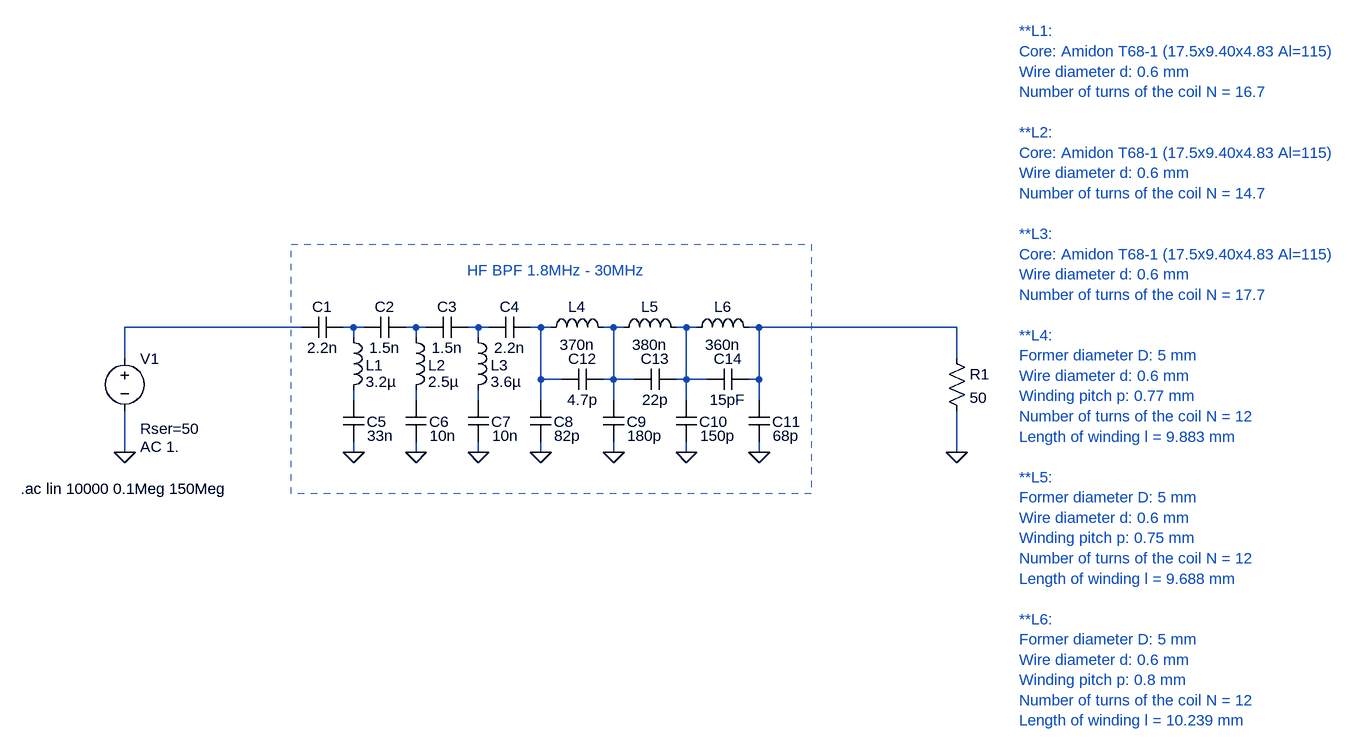
[diagram p0: schematic HF-BPF.asc]
HF-BPF.asc, the LTspice schematic file:
Version 4
SHEET 1 1608 680
WIRE -32 160 -304 160
WIRE 48 160 32 160
WIRE 64 160 48 160
WIRE 144 160 128 160
WIRE 160 160 144 160
WIRE 240 160 224 160
WIRE 256 160 240 160
WIRE 336 160 320 160
WIRE 352 160 336 160
WIRE 448 160 432 160
WIRE 464 160 448 160
WIRE 560 160 544 160
WIRE 576 160 560 160
WIRE 672 160 656 160
WIRE 976 160 672 160
WIRE 48 176 48 160
WIRE 144 176 144 160
WIRE 240 176 240 160
WIRE -304 208 -304 160
WIRE 976 208 976 160
WIRE 336 240 336 160
WIRE 368 240 336 240
WIRE 448 240 448 160
WIRE 448 240 432 240
WIRE 480 240 448 240
WIRE 560 240 560 160
WIRE 560 240 544 240
WIRE 592 240 560 240
WIRE 672 240 672 160
WIRE 672 240 656 240
WIRE 48 272 48 256
WIRE 144 272 144 256
WIRE 240 272 240 256
WIRE 336 272 336 240
WIRE 448 272 448 240
WIRE 560 272 560 240
WIRE 672 272 672 240
WIRE -304 352 -304 288
WIRE 48 352 48 336
WIRE 144 352 144 336
WIRE 240 352 240 336
WIRE 336 352 336 336
WIRE 448 352 448 336
WIRE 560 352 560 336
WIRE 672 352 672 336
WIRE 976 352 976 288
FLAG 48 352 0
FLAG 144 352 0
FLAG 240 352 0
FLAG 976 352 0
FLAG -304 352 0
FLAG 336 352 0
FLAG 448 352 0
FLAG 560 352 0
FLAG 672 352 0
SYMBOL cap 32 144 R90
WINDOW 0 0 32 VBottom 2
WINDOW 3 32 32 VTop 2
SYMATTR InstName C1
SYMATTR Value 2.2n
SYMBOL cap 128 144 R90
WINDOW 0 0 32 VBottom 2
WINDOW 3 32 32 VTop 2
SYMATTR InstName C2
SYMATTR Value 1.5n
SYMBOL cap 224 144 R90
WINDOW 0 0 32 VBottom 2
WINDOW 3 32 32 VTop 2
SYMATTR InstName C3
SYMATTR Value 1.5n
SYMBOL cap 320 144 R90
WINDOW 0 0 32 VBottom 2
WINDOW 3 32 32 VTop 2
SYMATTR InstName C4
SYMATTR Value 2.2n
SYMBOL ind 32 160 R0
WINDOW 0 35 58 Left 2
WINDOW 3 35 84 Left 2
SYMATTR InstName L1
SYMATTR Value 3.2µ
SYMBOL ind 128 160 R0
WINDOW 0 35 58 Left 2
WINDOW 3 35 84 Left 2
SYMATTR InstName L2
SYMATTR Value 2.5µ
SYMBOL ind 224 160 R0
WINDOW 0 35 58 Left 2
WINDOW 3 35 84 Left 2
SYMATTR InstName L3
SYMATTR Value 3.6µ
SYMBOL cap 32 272 R0
WINDOW 0 36 33 Left 2
WINDOW 3 37 55 Left 2
SYMATTR InstName C5
SYMATTR Value 33n
SYMBOL cap 128 272 R0
WINDOW 0 36 33 Left 2
WINDOW 3 37 55 Left 2
SYMATTR InstName C6
SYMATTR Value 10n
SYMBOL cap 224 272 R0
WINDOW 0 36 33 Left 2
WINDOW 3 37 55 Left 2
SYMATTR InstName C7
SYMATTR Value 10n
SYMBOL res 960 192 R0
SYMATTR InstName R1
SYMATTR Value 50
SYMBOL voltage -304 192 R0
WINDOW 3 24 152 Left 2
WINDOW 123 0 0 Left 0
WINDOW 39 24 124 Left 2
SYMATTR Value AC 1.
SYMATTR SpiceLine Rser=50
SYMATTR InstName V1
SYMBOL ind 336 176 R270
WINDOW 0 32 56 VTop 2
WINDOW 3 5 56 VBottom 2
SYMATTR InstName L4
SYMATTR Value 370n
SYMBOL ind 448 176 R270
WINDOW 0 32 56 VTop 2
WINDOW 3 5 56 VBottom 2
SYMATTR InstName L5
SYMATTR Value 380n
SYMBOL ind 560 176 R270
WINDOW 0 32 56 VTop 2
WINDOW 3 5 56 VBottom 2
SYMATTR InstName L6
SYMATTR Value 360n
SYMBOL cap 320 272 R0
WINDOW 0 36 33 Left 2
WINDOW 3 37 55 Left 2
SYMATTR InstName C8
SYMATTR Value 82p
SYMBOL cap 432 272 R0
WINDOW 0 36 33 Left 2
WINDOW 3 37 55 Left 2
SYMATTR InstName C9
SYMATTR Value 180p
SYMBOL cap 544 272 R0
WINDOW 0 36 33 Left 2
WINDOW 3 37 55 Left 2
SYMATTR InstName C10
SYMATTR Value 150p
SYMBOL cap 656 272 R0
WINDOW 0 36 33 Left 2
WINDOW 3 37 55 Left 2
SYMATTR InstName C11
SYMATTR Value 68p
SYMBOL cap 432 224 R90
WINDOW 0 0 32 VBottom 2
WINDOW 3 32 32 VTop 2
SYMATTR InstName C12
SYMATTR Value 4.7p
SYMBOL cap 544 224 R90
WINDOW 0 0 32 VBottom 2
WINDOW 3 32 32 VTop 2
SYMATTR InstName C13
SYMATTR Value 22p
SYMBOL cap 656 224 R90
WINDOW 0 0 32 VBottom 2
WINDOW 3 32 32 VTop 2
SYMATTR InstName C14
SYMATTR Value 15pF
TEXT -464 408 Left 2 !.ac lin 10000 0.1Meg 150Meg
TEXT 360 72 Center 2 ;HF BPF 1.8MHz - 30MHz
TEXT 1072 -296 Left 2 ;**L1:\nCore: Amidon T68-1 (17.5x9.40x4.83 Al=115)\nWire diameter d: 0.6 mm\nNumber of turns of the coil N = 16.7\n \n**L2:\nCore: Amidon T68-1 (17.5x9.40x4.83 Al=115)\nWire diameter d: 0.6 mm\nNumber of turns of the coil N = 14.7\n \n**L3:\nCore: Amidon T68-1 (17.5x9.40x4.83 Al=115)\nWire diameter d: 0.6 mm\nNumber of turns of the coil N = 17.7\n \n**L4:\nFormer diameter D: 5 mm\nWire diameter d: 0.6 mm\nWinding pitch p: 0.77 mm\nNumber of turns of the coil N = 12\nLength of winding l = 9.883 mm\n \n**L5:\nFormer diameter D: 5 mm\nWire diameter d: 0.6 mm\nWinding pitch p: 0.75 mm\nNumber of turns of the coil N = 12\nLength of winding l = 9.688 mm\n \n**L6:\nFormer diameter D: 5 mm\nWire diameter d: 0.6 mm\nWinding pitch p: 0.8 mm\nNumber of turns of the coil N = 12\nLength of winding l = 10.239 mm
RECTANGLE Normal 752 416 -48 32 2

The netlist it stands for:
* HF-BPF.asc
C1 N002 N001 2.2n
C2 N003 N002 1.5n
C3 N004 N003 1.5n
C4 N005 N004 2.2n
L1 N002 N009 3.2µ
L2 N003 N010 2.5µ
L3 N004 N011 3.6µ
C5 N009 0 33n
C6 N010 0 10n
C7 N011 0 10n
R1 N008 0 50
V1 N001 0 AC 1. Rser=50
L4 N005 N006 370n
L5 N006 N007 380n
L6 N007 N008 360n
C8 N005 0 82p
C9 N006 0 180p
C10 N007 0 150p
C11 N008 0 68p
C12 N006 N005 4.7p
C13 N007 N006 22p
C14 N008 N007 15pF
.ac lin 10000 0.1Meg 150Meg
* HF BPF 1.8MHz - 30MHz
* **L1:
* Core: Amidon T68-1 (17.5x9.40x4.83 Al=115)
* Wire diameter d: 0.6 mm
* Number of turns of the coil N = 16.7
* **L2:
* Core: Amidon T68-1 (17.5x9.40x4.83 Al=115)
* Wire diameter d: 0.6 mm
* Number of turns of the coil N = 14.7
* **L3:
* Core: Amidon T68-1 (17.5x9.40x4.83 Al=115)
* Wire diameter d: 0.6 mm
* Number of turns of the coil N = 17.7
* **L4:
* Former diameter D: 5 mm
* Wire diameter d: 0.6 mm
* Winding pitch p: 0.77 mm
* Number of turns of the coil N = 12
* Length of winding l = 9.883 mm
* **L5:
* Former diameter D: 5 mm
* Wire diameter d: 0.6 mm
* Winding pitch p: 0.75 mm
* Number of turns of the coil N = 12
* Length of winding l = 9.688 mm
* **L6:
* Former diameter D: 5 mm
* Wire diameter d: 0.6 mm
* Winding pitch p: 0.8 mm
* Number of turns of the coil N = 12
* Length of winding l = 10.239 mm
.backanno
.end